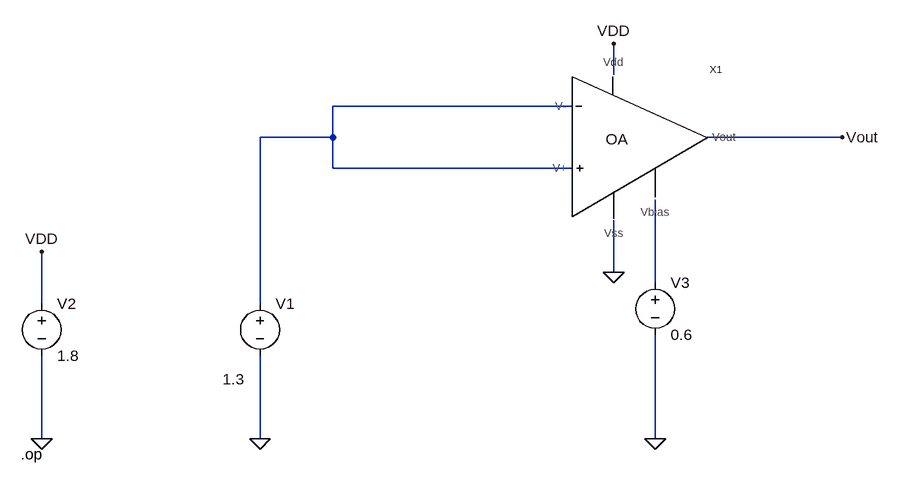
[diagram p0: schematic OPAMP_OP_TB.asc]
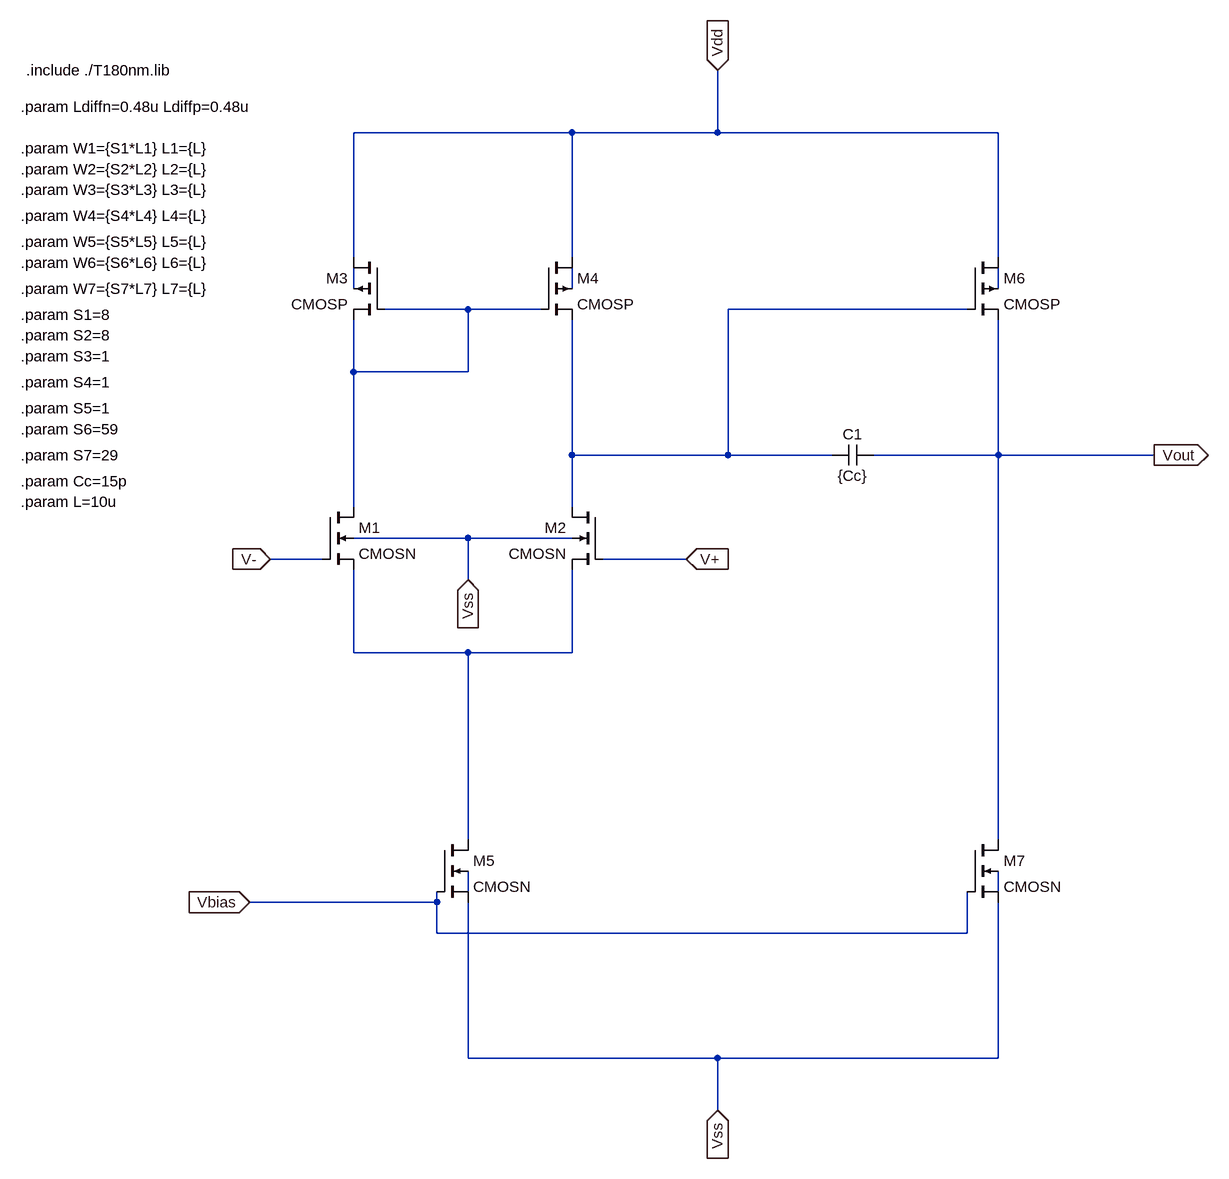
[diagram p1: sub-circuit opamp.asc]
OPAMP_OP_TB.asc, the LTspice schematic file:
Version 4
SHEET 1 880 1476
WIRE 224 32 224 -16
WIRE 160 80 -208 80
WIRE -208 128 -208 80
WIRE -208 128 -320 128
WIRE 576 128 368 128
WIRE -208 176 -208 128
WIRE 160 176 -208 176
WIRE 224 336 224 256
WIRE 288 352 288 224
WIRE -656 384 -656 304
WIRE -320 384 -320 128
WIRE -656 592 -656 464
WIRE -320 592 -320 464
WIRE 288 592 288 432
FLAG 224 336 0
FLAG 224 -16 VDD
FLAG -656 592 0
FLAG -320 592 0
FLAG -656 304 VDD
FLAG 576 128 Vout
FLAG 288 592 0
SYMBOL voltage -320 368 R0
WINDOW 3 -57 132 Left 2
WINDOW 123 0 0 Left 2
WINDOW 39 0 0 Left 2
SYMATTR Value 1.3
SYMATTR InstName V1
SYMBOL voltage -656 368 R0
WINDOW 123 0 0 Left 2
WINDOW 39 0 0 Left 2
SYMATTR InstName V2
SYMATTR Value 1.8
SYMBOL opamp 224 128 R0
SYMATTR InstName X1
SYMBOL voltage 288 336 R0
WINDOW 123 0 0 Left 0
WINDOW 39 0 0 Left 0
SYMATTR InstName V3
SYMATTR Value 0.6
TEXT -688 616 Left 2 !.op

opamp.asc, the sub-circuit schematic file:
Version 4
SHEET 1 1808 1360
WIRE 48 -448 -288 -448
WIRE 272 -448 272 -544
WIRE 272 -448 48 -448
WIRE 704 -448 272 -448
WIRE -288 -256 -288 -448
WIRE 48 -256 48 -448
WIRE 704 -256 704 -448
WIRE -288 -208 -288 -240
WIRE 48 -208 48 -240
WIRE 704 -208 704 -240
WIRE -112 -176 -240 -176
WIRE 0 -176 -112 -176
WIRE 656 -176 288 -176
WIRE -288 -80 -288 -160
WIRE -112 -80 -112 -176
WIRE -112 -80 -288 -80
WIRE 48 48 48 -160
WIRE 288 48 288 -176
WIRE 288 48 48 48
WIRE 448 48 288 48
WIRE 704 48 704 -160
WIRE 704 48 512 48
WIRE 944 48 704 48
WIRE -288 128 -288 -80
WIRE 48 128 48 48
WIRE -112 176 -288 176
WIRE 48 176 -112 176
WIRE -336 208 -416 208
WIRE 224 208 96 208
WIRE -112 240 -112 176
WIRE -288 352 -288 224
WIRE -112 352 -288 352
WIRE 48 352 48 224
WIRE 48 352 -112 352
WIRE -112 640 -112 352
WIRE 704 640 704 48
WIRE -112 720 -112 688
WIRE 704 720 704 688
WIRE -160 736 -160 720
WIRE -160 736 -448 736
WIRE -160 784 -160 736
WIRE 656 784 656 720
WIRE 656 784 -160 784
WIRE -112 976 -112 736
WIRE 272 976 -112 976
WIRE 704 976 704 736
WIRE 704 976 272 976
WIRE 272 1056 272 976
FLAG 272 1056 Vss
IOPIN 272 1056 In
FLAG -448 736 Vbias
IOPIN -448 736 In
FLAG -112 240 Vss
IOPIN -112 240 In
FLAG -416 208 V-
IOPIN -416 208 In
FLAG 224 208 V+
IOPIN 224 208 In
FLAG 272 -544 Vdd
IOPIN 272 -544 In
FLAG 944 48 Vout
IOPIN 944 48 Out
DATAFLAG 48 -32 "Id(x1:M2)"
DATAFLAG -288 -16 "Id(x1:M1)"
DATAFLAG -112 512 "Id(x1:M5)"
DATAFLAG 288 -176 ""
DATAFLAG 496 -448 ""
DATAFLAG 704 288 "Id(x1:M7)"
DATAFLAG 704 -48 "Id(x1:M6)"
DATAFLAG -128 -80 ""
DATAFLAG -96 352 ""
DATAFLAG 800 48 ""
DATAFLAG 256 784 ""
DATAFLAG -384 208 ""
DATAFLAG 160 208 ""
SYMBOL nmos4 -336 128 R0
SYMATTR InstName M1
SYMATTR Value CMOSN
SYMATTR Value2 l={L1} w={W1} ad={Ldiffn*W1} as={Ldiffn*W1} pd={2*Ldiffn+W1} ps={2*Ldiffn+W1}
SYMBOL nmos4 96 128 M0
SYMATTR InstName M2
SYMATTR Value CMOSN
SYMATTR Value2 l={L2} w={W2} ad={Ldiffn*W2} as={Ldiffn*W2} pd={2*Ldiffn+W2} ps={2*Ldiffn+W2}
SYMBOL pmos4 -240 -256 M0
SYMATTR InstName M3
SYMATTR Value CMOSP
SYMATTR Value2 l={L3} w={W3} ad={Ldiffp*W3} as={Ldiffp*W3} pd={2*Ldiffp+W3} ps={2*Ldiffp+W3}
SYMBOL pmos4 0 -256 R0
SYMATTR InstName M4
SYMATTR Value CMOSP
SYMATTR Value2 l={L4} w={W4} ad={Ldiffp*W4} as={Ldiffp*W4} pd={2*Ldiffp+W4} ps={2*Ldiffp+W4}
SYMBOL nmos4 -160 640 R0
SYMATTR InstName M5
SYMATTR Value CMOSN
SYMATTR Value2 l={L5} w={W5} ad={Ldiffn*W5} as={Ldiffn*W5} pd={2*Ldiffn+W5} ps={2*Ldiffn+W5}
SYMBOL pmos4 656 -256 R0
SYMATTR InstName M6
SYMATTR Value CMOSP
SYMATTR Value2 l={L6} w={W6} ad={Ldiffp*W6} as={Ldiffp*W6} pd={2*Ldiffp+W6} ps={2*Ldiffp+W6}
SYMBOL nmos4 656 640 R0
SYMATTR InstName M7
SYMATTR Value CMOSN
SYMATTR Value2 l={L7} w={W7} ad={Ldiffn*W7} as={Ldiffn*W7} pd={2*Ldiffn+W7} ps={2*Ldiffn+W7}
SYMBOL cap 512 32 R90
WINDOW 0 0 32 VBottom 2
WINDOW 3 32 32 VTop 2
SYMATTR InstName C1
SYMATTR Value {Cc}
TEXT -792 -544 Left 2 !.include ./T180nm.lib
TEXT -800 -488 Left 2 !.param Ldiffn=0.48u Ldiffp=0.48u
TEXT -800 -424 Left 2 !.param W1={S1*L1} L1={L}
TEXT -800 -392 Left 2 !.param W2={S2*L2} L2={L}
TEXT -800 -360 Left 2 !.param W3={S3*L3} L3={L}
TEXT -800 -320 Left 2 !.param W4={S4*L4} L4={L}
TEXT -800 -280 Left 2 !.param W5={S5*L5} L5={L}
TEXT -800 88 Left 2 !.param Cc=15p
TEXT -800 120 Left 2 !.param L=10u
TEXT -800 -248 Left 2 !.param W6={S6*L6} L6={L}
TEXT -800 -208 Left 2 !.param W7={S7*L7} L7={L}
TEXT -800 -168 Left 2 !.param S1=8
TEXT -800 -136 Left 2 !.param S2=8
TEXT -800 -104 Left 2 !.param S3=1
TEXT -800 -64 Left 2 !.param S4=1
TEXT -800 -24 Left 2 !.param S5=1
TEXT -800 8 Left 2 !.param S6=59
TEXT -800 48 Left 2 !.param S7=29

The netlist it stands for:
* OPAMP_OP_TB.asc
V1 N001 0 1.3
V2 VDD 0 1.8
XX1 N001 VDD 0 Vout N001 N002 opamp
V3 N002 0 0.6

* block symbol definitions
.subckt opamp V- Vdd Vss Vout V+ Vbias
M1 N004 V- N006 Vss CMOSN l={L1} w={W1} ad={Ldiffn*W1} as={Ldiffn*W1} pd={2*Ldiffn+W1} ps={2*Ldiffn+W1}
M2 N005 V+ N006 Vss CMOSN l={L2} w={W2} ad={Ldiffn*W2} as={Ldiffn*W2} pd={2*Ldiffn+W2} ps={2*Ldiffn+W2}
M3 Vdd N004 N004 N001 CMOSP l={L3} w={W3} ad={Ldiffp*W3} as={Ldiffp*W3} pd={2*Ldiffp+W3} ps={2*Ldiffp+W3}
M4 Vdd N004 N005 N002 CMOSP l={L4} w={W4} ad={Ldiffp*W4} as={Ldiffp*W4} pd={2*Ldiffp+W4} ps={2*Ldiffp+W4}
M5 N006 Vbias Vss N007 CMOSN l={L5} w={W5} ad={Ldiffn*W5} as={Ldiffn*W5} pd={2*Ldiffn+W5} ps={2*Ldiffn+W5}
M6 Vdd N005 Vout N003 CMOSP l={L6} w={W6} ad={Ldiffp*W6} as={Ldiffp*W6} pd={2*Ldiffp+W6} ps={2*Ldiffp+W6}
M7 Vout Vbias Vss N008 CMOSN l={L7} w={W7} ad={Ldiffn*W7} as={Ldiffn*W7} pd={2*Ldiffn+W7} ps={2*Ldiffn+W7}
C1 Vout N005 {Cc}
.include ./T180nm.lib
.param Ldiffn=0.48u Ldiffp=0.48u
.param W1={S1*L1} L1={L}
.param W2={S2*L2} L2={L}
.param W3={S3*L3} L3={L}
.param W4={S4*L4} L4={L}
.param W5={S5*L5} L5={L}
.param Cc=15p
.param L=10u
.param W6={S6*L6} L6={L}
.param W7={S7*L7} L7={L}
.param S1=8
.param S2=8
.param S3=1
.param S4=1
.param S5=1
.param S6=59
.param S7=29
.ends opamp

.model NMOS NMOS
.model PMOS PMOS
.lib standard.mos
.op
.backanno
.end